# Altium schematic sheet Glucometer-I.C.- RF Module V3.SchDoc
size Letter
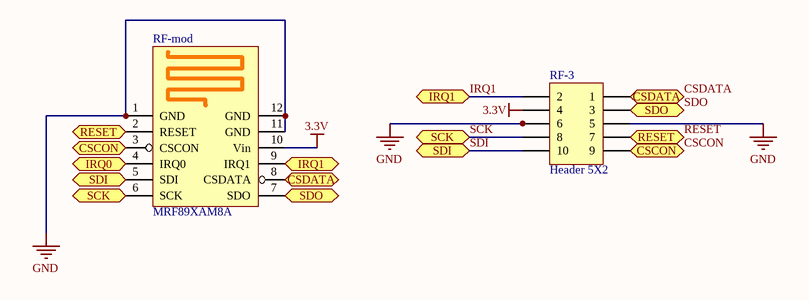
[diagram p0: Glucometer-I.C.- RF Module V3.SchDoc]

## Parts
RF-3  Header 5X2  [HDR2X5]
RF-mod  MRF89XAM8A  [MRF89XAM8A]

## Ports
CSCON, CSDATA, IRQ0, IRQ1, RESET, SCK, SDI, SDO

## Nets
3.3V: RF-3.4 RF-mod.10(Vin)
GND: RF-3.5 RF-3.6 RF-mod.1(GND) RF-mod.11(GND) RF-mod.12(GND)
CSCON: RF-3.9 RF-mod.3(CSCON) ; port CSCON
CSDATA: RF-3.1 RF-mod.8(CSDATA) ; port CSDATA
IRQ0: RF-mod.4(IRQ0) ; port IRQ0
IRQ1: RF-3.2 RF-mod.9(IRQ1) ; port IRQ1
RESET: RF-3.7 RF-mod.2(RESET) ; port RESET
SCK: RF-3.8 RF-mod.6(SCK) ; port SCK
SDI: RF-3.10 RF-mod.5(SDI) ; port SDI
SDO: RF-3.3 RF-mod.7(SDO) ; port SDO

## Library data of the parts
RF-3 = Header 5X2: Header, 5-Pin, Dual row; LatestRevisionDate: 17-Jul-2002; LatestRevisionNote: Re-released for DXP Platform.; Publisher: Altium Limited
RF-mod = MRF89XAM8A: RF Module. 868MHz Ultra Low Power Sub-Ghz Transceiver Module